# Altium schematic sheet BMS_v3.SchDoc
size A4; SheetTotal: 1
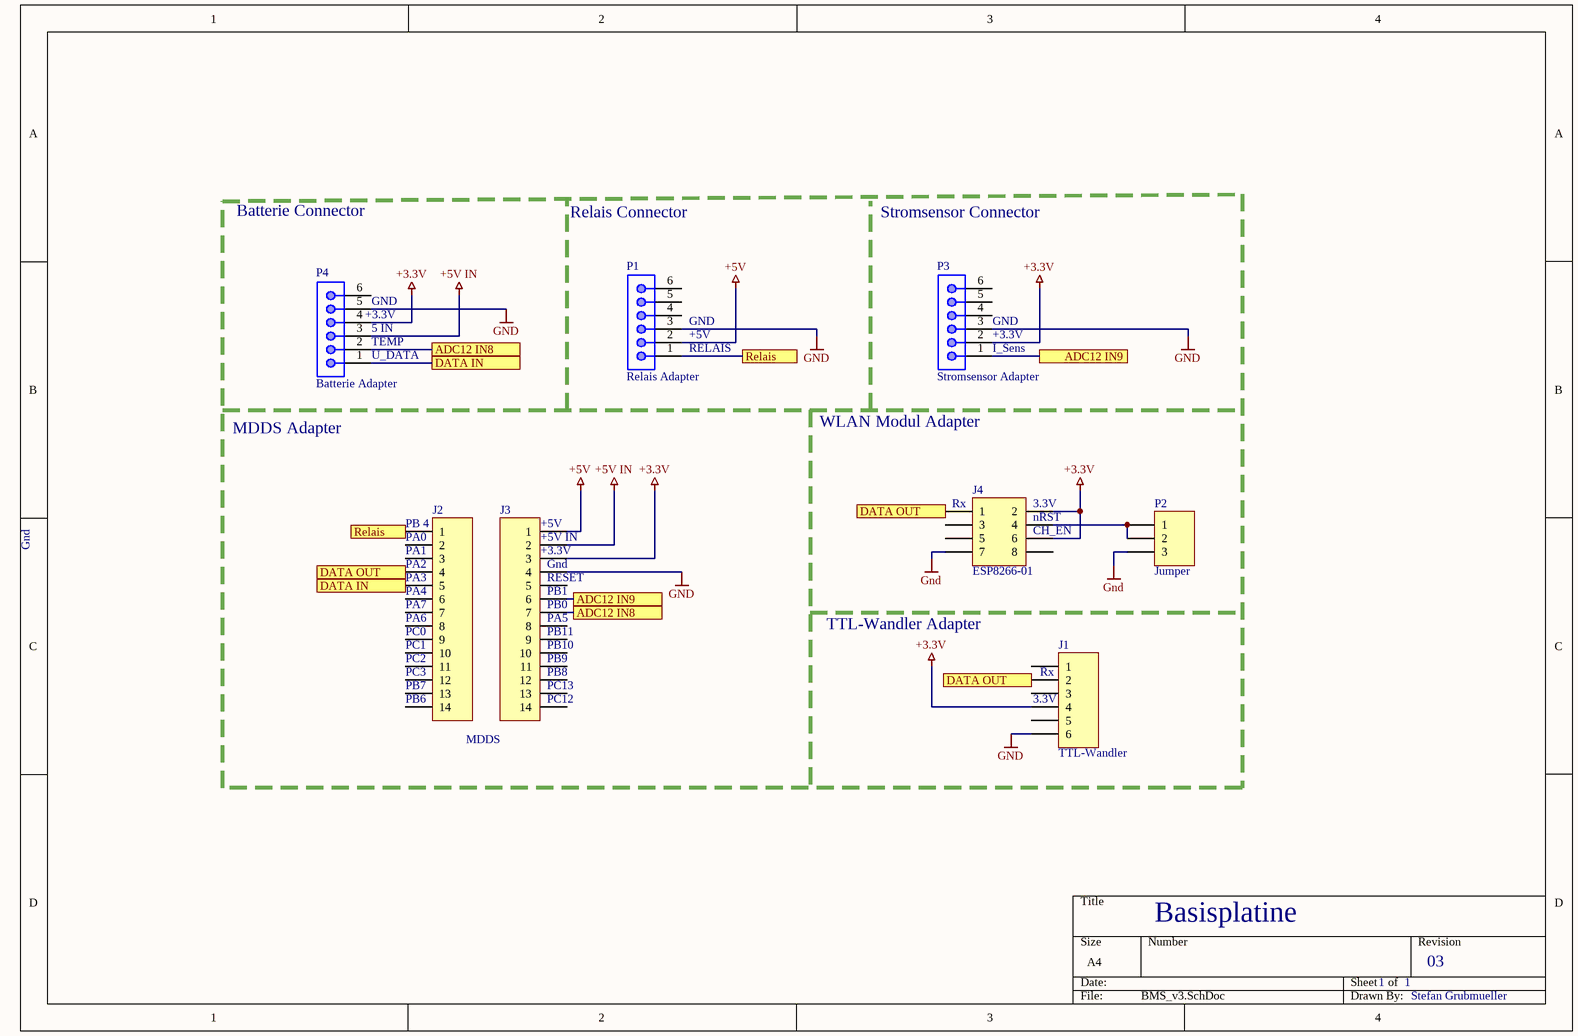
[diagram p0: BMS_v3.SchDoc]

## Parts
J1  TTL-Wandler  [HDR1X6]
J2  Header 14  [HDR1X14]  (value not drawn)
J3  Header 14  [HDR1X14]  (value not drawn)
J4  ESP8266-01  [HDR2X4]
P1  Relais Adapter  [62000611622]
P2  Jumper  [HDR1X3]
P3  Stromsensor Adapter  [62000611622]
P4  Batterie Adapter  [62000611622]

## Ports
ADC12 IN8, ADC12 IN9, DATA IN, DATA OUT, Relais

## Nets
+3.3V: J1.4 J3.3 J4.2 J4.6 P3.2 P4.4
+5V: J3.1 P1.2
+5V IN: J3.2 P4.3
Gnd: J1.6 J3.4 J4.7 P1.3 P2.3 P3.3 P4.5
ADC12 IN8: J3.7 P4.2 ; port ADC12 IN8
ADC12 IN9: J3.6 P3.1 ; port ADC12 IN9
DATA IN: J2.5 P4.1 ; port DATA IN
DATA OUT: J1.2 J2.4 J4.1 ; port DATA OUT
Relais: J2.1 P1.1 ; port Relais
NetJ4_4: J4.4 P2.1 P2.2

Not connected (* = marked no-connect by the designer): J1 1 3 5; J2 2 3 6 7 8 9 10 11 12 13 14; J3 5 8 9 10 11 12 13 14; J4 3 5 8; P1 4 5 6; P3 4 5 6; P4 6

## Notes on the sheet
- Batterie Connector
- Relais Connector
- Stromsensor Connector
- (near P4) GND
- (near P4) +3.3V
- (near P4) U_DATA
- (near P4) TEMP
- (near P4) 5 IN
- (near P1) RELAIS
- (near P1) +5V
- (near P1) GND
- (near P3) I_Sens
- (near P3) +3.3V
- (near P3) GND
- MDDS Adapter
- WLAN Modul Adapter
- (near J4) Rx
- (near J4) 3.3V
- (near J4) nRST
- Gnd
- (near J2) PA2
- (near J2) PA3
- (near J2) PB 4
- (near J2) PA0
- (near J2) PA1
- (near J3) +3.3V
- (near J3) +5V IN
- (near J3) +5V
- (near J3) Gnd
- (near J3) RESET
- (near J4) CH_EN
- (near J2) PA4
- (near J2) PA7
- (near J2) PA6
- (near J2) PC0
- (near J2) PC1
- (near J3) PB1
- (near J3) PB0
- (near J3) PB10
- (near J3) PB11
- (near J3) PA5
- TTL-Wandler Adapter
- (near J2) PC2
- (near J2) PC3
- (near J2) PB7
- (near J2) PB6
- (near J3) PC12
- (near J3) PC13
- (near J3) PB8
- (near J3) PB9
- (near J1) 3.3V
- (near J1) Rx
- MDDS
- Basisplatine
- 1
- 03
- Stefan Grubmueller

## Library data of the parts
J1 = Header 6: Header, 6-Pin; LatestRevisionDate: 17-Jul-2002; LatestRevisionNote: Re-released for DXP Platform.; Publisher: Altium Limited
J2 J3 = Header 14: Header, 14-Pin; LatestRevisionDate: 17-Jul-2002; LatestRevisionNote: Re-released for DXP Platform.; Publisher: Altium Limited
J4 = Header 4X2: Header, 4-Pin, Dual row; LatestRevisionDate: 17-Jul-2002; LatestRevisionNote: Re-released for DXP Platform.; Publisher: Altium Limited
P1 P3 P4 = 62000611622: WR-WTB Male Vertical Shrouded Header, pitch 2mm, 6p; Pin Number: 6; Contact Resistance: 20mOhm; Rated Current: 2A; Withstanding Voltage: 800VAC; Working Voltage: 125VAC; ComponentLink1Description: Manufacturer; ComponentLink1URL: http://www.we-online.de; ComponentLink2Description: Datasheet; ComponentLink2URL: https://www.we-online.com/catalog/datasheet/62000611622.pdf; Pitch: 2mm; Published Date: January 2020; Publisher: Wurth Elektronik; Mounting Technology: THT; Packaging: Bag; Operating Temperature: -25 to +85degC; Part Number: 62000611622; Gender: Male; Type: Vertical
P2 = Header 3: Header, 3-Pin; LatestRevisionDate: 17-Jul-2002; LatestRevisionNote: Re-released for DXP Platform.; Publisher: Altium Limited